# EAGLE design twip-pb2 (EAGLE 9.2.1)
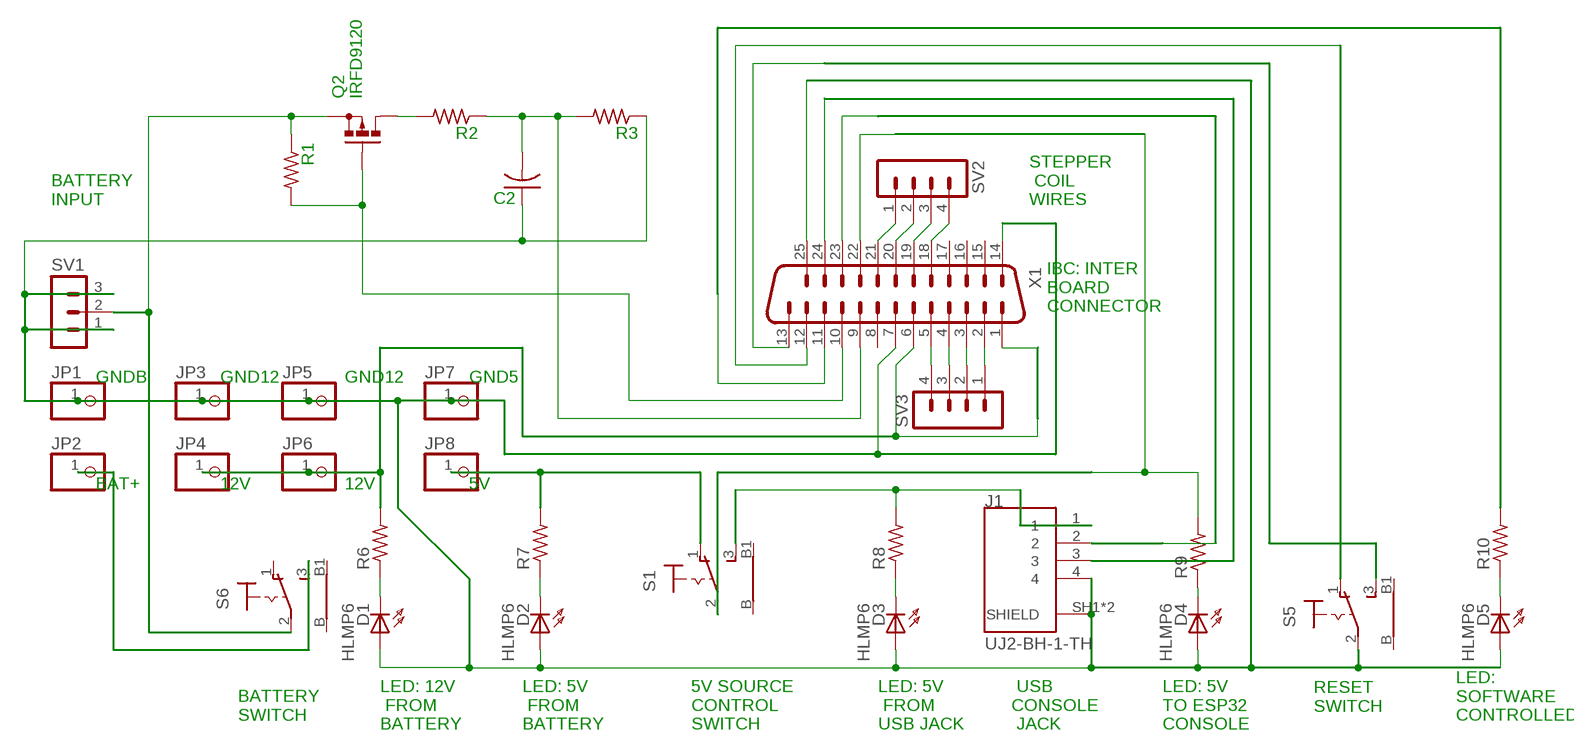
[diagram p0: schematic, sheet 1]

## Parts
C2  C-US050-025X075  [C050-025X075]
D1  HLMP6  [HLMP6]
D2  HLMP6  [HLMP6]
D3  HLMP6  [HLMP6]
D4  HLMP6  [HLMP6]
D5  HLMP6  [HLMP6]
J1  UJ2-BH-1-TH  [CUI_UJ2-BH-1-TH]
JP1  PINHD-1X1  [1X01]
JP2  PINHD-1X1  [1X01]
JP3  PINHD-1X1  [1X01]
JP4  PINHD-1X1  [1X01]
JP5  PINHD-1X1  [1X01]
JP6  PINHD-1X1  [1X01]
JP7  PINHD-1X1  [1X01]
JP8  PINHD-1X1  [1X01]
Q2  IRFD9120  [C370-01]
R1  R-US_0207/10  [0207/10]
R2  R-US_0207/10  [0207/10]
R3  R-US_0207/10  [0207/10]
R6  R-US_0207/10  [0207/10]
R7  R-US_0207/10  [0207/10]
R8  R-US_0207/10  [0207/10]
R9  R-US_0207/10  [0207/10]
R10  R-US_0207/10  [0207/10]
S1  9070-1W  [9070-1W]
S5  9070-1W  [9070-1W]
S6  9070-1W  [9070-1W]
SV1  MA03-1  [MA03-1]
SV2  MA04-1  [MA04-1]
SV3  MA04-1  [MA04-1]
X1  M25VP  [M25VP]

## Nets
N$1: D4.K R9.1
N$2: D1.K R6.1
N$3: D2.K R7.1
N$4: C2.1 D1.A D2.A D3.A D4.A D5.A J1.4 J1.SH1(SHIELD) J1.SH2(SHIELD) JP1.1 JP3.1 JP5.1 JP7.1 R3.1 S5.2(P) SV1.1 SV1.3 X1.7 X1.14 X1.25
N$5: D3.K R8.1
N$6: JP8.1 R7.2 S1.1(O)
N$7: Q2.S R1.1 S6.2(P) SV1.2
N$8: JP4.1 JP6.1 R6.2 X1.1 X1.6
N$9: D5.K R10.1
N$10: JP2.1 S6.3(S)
N$11: SV2.1 X1.21
N$12: S5.1(O) X1.12
N$13: J1.1 R8.2 S1.3(S)
N$14: SV3.1 X1.2
N$15: SV3.2 X1.3
N$16: SV3.3 X1.4
N$17: SV3.4 X1.5
N$18: SV2.2 X1.20
N$19: SV2.3 X1.19
N$20: SV2.4 X1.18
N$21: R10.2 X1.11
N$22: J1.2 X1.23
N$23: J1.3 X1.24
N$24: R9.2 S1.2(P) X1.22
N$25: Q2.D Q2.D1(D) R2.2
N$26: Q2.G R1.2 X1.10
N$28: S5.3(S) X1.13
N$29: C2.2 R2.1 R3.2 X1.9
Unconnected: S1.B S1.B1 S5.B S5.B1 S6.1(O) S6.B S6.B1 X1.8 X1.15 X1.16 X1.17 X1.G1 X1.G2

## Notes on the sheet
- BATTERY
  INPUT
- STEPPER
   COIL
  WIRES
- IBC: INTER 
  BOARD 
  CONNECTOR
- GNDB | GND12 | GND12 | GND5
- BAT+ | 12V | 12V | 5V
- RESET
  SWITCH
- BATTERY 
  SWITCH
- LED: 
  SOFTWARE
  CONTROLLED
- LED: 12V
   FROM
  BATTERY
- LED: 5V
   FROM
  BATTERY
- 5V SOURCE
  CONTROL
  SWITCH
- LED: 5V
   FROM
  USB JACK
- USB
  CONSOLE
   JACK
- LED: 5V
  TO ESP32
  CONSOLE

## Library data of the parts
C2 = rcl:C-US: CAPACITOR, American symbol; SPICEPREFIX: C
D1-D5 = display-hp:HLMP6: LED 2mm horizontal; MF: AGILENT TECHNOLOGIES; MPN: HLMP-6500; OC_FARNELL: 1652490; OC_NEWARK: 40K0088
J1 = UJ2-BH-1-TH:UJ2-BH-1-TH: 3 µin Plating Thickness, Black Insulator, USB Receptacle; MANUFACTURER: CUI INC; PART_REV: 1.0; STANDARD: MANUFACTURER RECOMENDATION
JP1-JP8 = pinhead:PINHD-1X1: PIN HEADER
Q2 = transistor-small-signal:IRFD9120: P-CHANNEL MOS FET
R1-R3 R6-R10 = rcl:R-US_: RESISTOR, American symbol; SPICEPREFIX: R
S1 S5 S6 = switch:9070-1W: TOGGLE SWITCH Marquardt
SV1 = con-lstb:MA03-1: PIN HEADER; OC_FARNELL: unknown; OC_NEWARK: unknown
SV2 SV3 = con-lstb:MA04-1: PIN HEADER; OC_FARNELL: unknown; OC_NEWARK: unknown
X1 = con-subd:M25VP: SUB-D; OC_FARNELL: unknown; OC_NEWARK: unknown

## Board
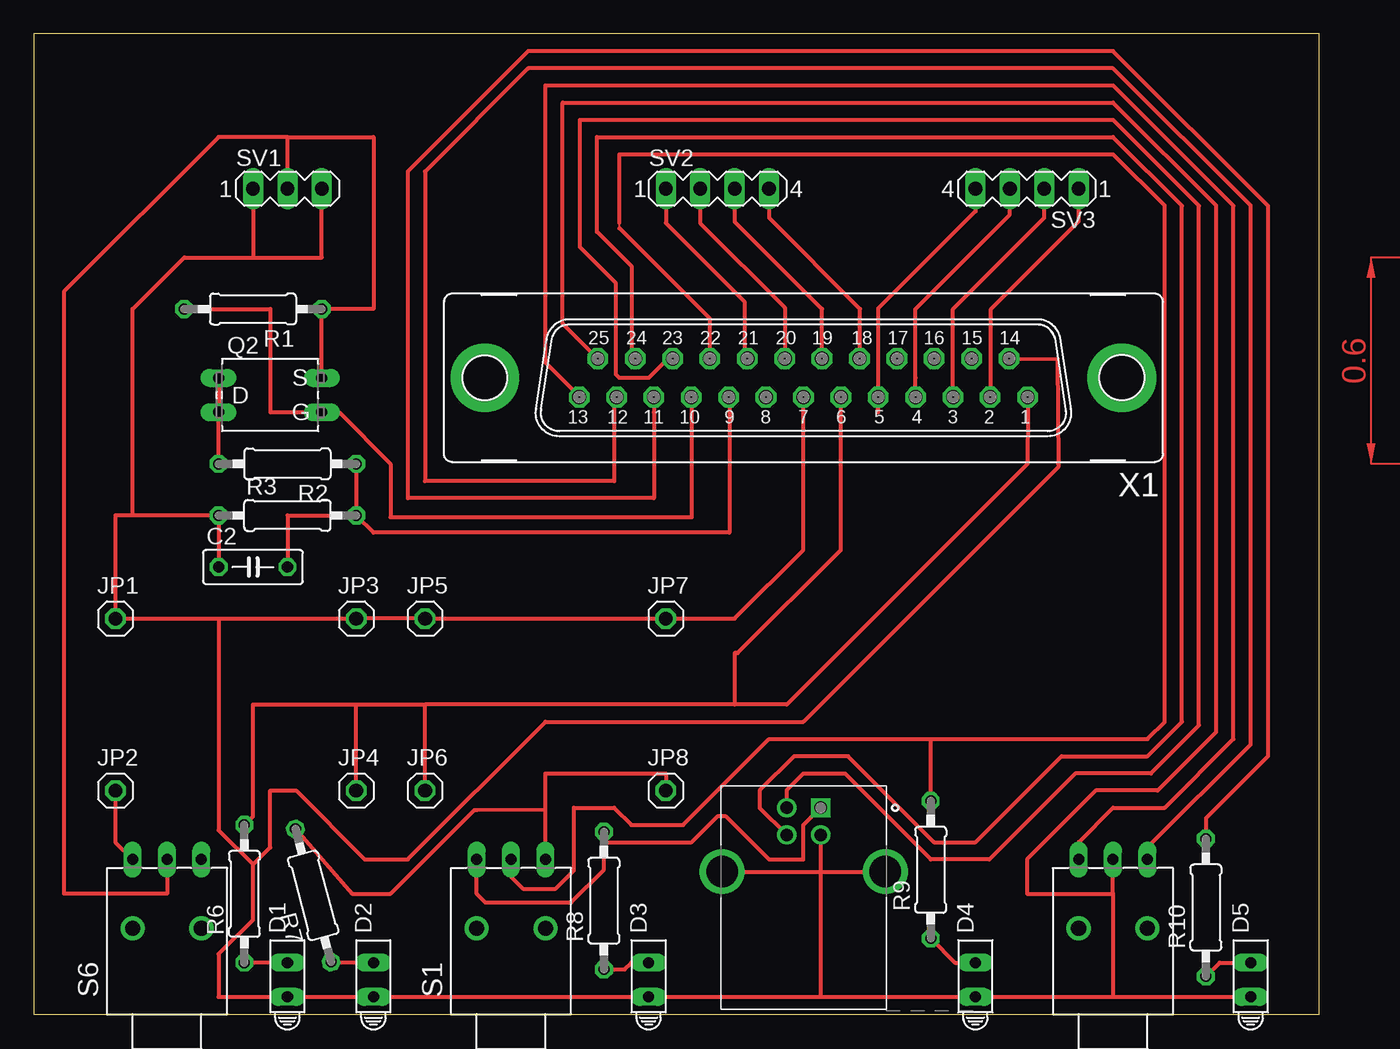
[diagram p1: board, top side]

Size 94.92 x 72.38 mm. Coordinates in mm from the lower left corner, seen from the top.
Outline: 94.92,72.38 0,72.38 0,0 94.92,0 94.92,72.38
Copper layers (1*16): Top 0.035mm / dielectric 1.5mm / Bottom 0.035mm
Design rules "default": minimum track width 6mil, minimum drill 0.35mm, track to track 6mil, track to pad 6mil, pad to pad 6mil, via to via 6mil, smd to smd 6mil, copper to edge 40mil, drill to drill 6mil, minimum pad ring 10mil, minimum via ring 8mil, stop-mask expansion 4mil, vias tented up to drill 0mil, thermal gap 10mil

### Footprints (pad centres in the part's own frame; a part is rotated, then mirrored left to right if it is on the bottom)
C050-025X075 = drill 0.813 octagon: 1 -2.54,0; 2 2.54,0
HLMP6 = drill 0.813 long: A -1.27,0; K 1.27,0
CUI_UJ2-BH-1-TH = drill 0.92 square: 1 0,0 | drill 0.92: 2 -2.5,0; 3 -2.5,-2; 4 0,-2 | drill 2.3: SH1 -7.27,-4.71; SH2 4.77,-4.71
1X01 = drill 1.016 octagon: 1 0,0
C370-01 = drill 0.813 long: D -3.81,1.27; D1 -3.81,-1.27; G 3.81,-1.27; S 3.81,1.27
0207/10 = drill 0.813 octagon: 1 -5.08,0; 2 5.08,0
9070-1W = drill 0.813 long: 1 5.08,-2.54; 2 5.08,0; 3 5.08,2.54 | drill 1.118 pad 1.778: B 0,-2.54; B1 0,2.54
MA03-1 = drill 1.016 long: 1 -2.54,0; 2 0,0; 3 2.54,0
MA04-1 = drill 1.016 long: 1 -3.81,0; 2 -1.27,0; 3 1.27,0; 4 3.81,0
M25VP = drill 1.016 octagon: 1 -16.561,1.422; 2 -13.792,1.422; 3 -11.049,1.422; 4 -8.28,1.422; 5 -5.512,1.422; 6 -2.769,1.422; 7 0,1.422; 8 2.769,1.422; 9 5.512,1.422; 10 8.28,1.422; 11 11.049,1.422; 12 13.792,1.422; 13 16.561,1.422; 14 -15.189,-1.422; 15 -12.421,-1.422; 16 -9.652,-1.422; 17 -6.909,-1.422; 18 -4.14,-1.422; 19 -1.372,-1.422; 20 1.372,-1.422; 21 4.14,-1.422; 22 6.909,-1.422; 23 9.652,-1.422; 24 12.421,-1.422; 25 15.189,-1.422 | drill 3.302 pad 5.08: G1 -23.52,0; G2 23.52,0

### Placement (x,y rotation side)
C2  16.18,33.01 0 top
D1  18.72,2.53 90 top
D2  25.07,2.53 90 top
D3  45.39,2.53 90 top
D4  69.52,2.53 90 top
D5  89.84,2.53 90 top
J1  58.09,15.23 0 top
JP1  6.02,29.2 0 top
JP2  6.02,16.5 0 top
JP3  23.8,29.2 0 top
JP4  23.8,16.5 0 top
JP5  28.88,29.2 0 top
JP6  28.88,16.5 0 top
JP7  46.66,29.2 0 top
JP8  46.66,16.5 0 top
Q2  17.45,45.71 0 top
R1  16.18,52.06 180 top
R2  18.72,40.63 180 top
R3  18.72,36.82 0 top
R6  15.54,8.88 90 top
R7  20.62,8.75 105 top
R8  42.09,8.37 90 top
R9  66.22,10.66 90 top
R10  86.54,7.86 90 top
S1  35.23,6.34 90 top
S5  79.68,6.34 90 top
S6  9.83,6.34 90 top
SV1  18.72,60.95 0 top
SV2  50.47,60.95 0 top
SV3  73.33,60.95 180 top
X1  56.82,46.98 180 top

### Tracks (layer width: path | path; a pad name or v marks a point on that pad's centre or on a via)
N$1
  Top 0.305: R9.1 68,3.8 D4.K
N$2
  Top 0.305: D1.K R6.1
N$3
  Top 0.152: 22.3,3.8 R7.1
  Top 0.305: D2.K 22.3,3.8
N$4
  Top 0.305: 13.64,29.2 JP1.1 6.02,36.82 7.29,36.82 | 13.64,29.2 JP3.1 JP5.1 JP7.1 51.74,29.2 56.82,34.28 X1.7 | 13.64,29.2 13.64,13.58 16.18,11.04 | 58.09,1.26 D3.A D2.A D1.A 13.64,1.26 13.64,4.44 16.18,6.98 16.18,11.04 | 58.09,1.26 D4.A 79.68,1.26 | 58.09,10.52 J1.SH2 | J1.4 58.09,10.52 | 58.09,10.52 58.09,1.26 | 79.68,1.26 D5.A | 79.68,8.88 S5.2 | 79.68,8.88 79.68,1.26 | 16.18,11.04 17.45,12.31 17.45,16.5 19.36,16.5 24.44,11.42 27.61,11.42 37.77,21.58 56.82,21.58 75.63,40.39 75.63,40.63 75.59,48.38 X1.14 | SV1.3 21.26,55.87 16.18,55.87 | 7.29,36.82 7.29,52.06 11.1,55.87 16.18,55.87 | C2.1 R3.1 7.29,36.82 | 79.68,8.88 73.33,8.88 73.33,11.42 78.41,16.5 82.98,16.5 87.3,20.82 87.3,59.68 79.68,67.3 39.04,67.3 39.04,50.99 X1.25 | J1.SH1 58.09,10.52 | SV1.1 16.18,55.87
N$5
  Top 0.305: R8.1 43.61,3.29 44.12,3.8 D3.K
N$6
  Top 0.305: S1.1 37.77,15.12 | 37.77,15.12 37.77,17.77 46.66,17.77 JP8.1 | 37.77,15.12 32.7,15.07 32.53,15.07 26.34,8.88 23.51,8.88 R7.2
N$7
  Top 0.305: S6.2 9.83,8.88 2.21,8.88 2.21,53.33 13.64,64.76 18.72,64.76 | SV1.2 18.72,64.76 | Q2.S R1.1 25.07,52.06 25.07,64.76 18.72,64.76
N$8
  Top 0.152: 73.38,44.44
  Top 0.305: X1.6 59.59,34.28 51.97,26.66 51.74,26.66 51.74,22.85 | JP6.1 28.88,22.85 | 23.8,22.85 28.88,22.85 | JP4.1 23.8,22.85 | R6.2 16.18,14.6 16.18,22.85 23.8,22.85 | 51.74,22.85 28.88,22.85 | 73.38,44.44 73.37,40.63 55.59,22.85 51.74,22.85 | X1.1 73.38,44.44
N$9
  Top 0.305: R10.1 87.55,3.8 D5.K
N$10
  Top 0.305: JP2.1 6.02,12.69 S6.3
N$11
  Top 0.305: SV2.1 46.66,58.41 52.5,52.57 52.5,48.58 X1.21
N$12
  Top 0.305: S5.1 82.22,12.31 89.84,19.93 89.84,59.68 79.68,69.84 36.5,69.84 28.88,62.22 28.88,39.36 42.85,39.36 42.85,45.38 X1.12
N$13
  Top 0.152: 42.09,13.33 R8.2
  Top 0.305: J1.1 56.82,13.96 56.82,11.42 54.28,11.42 51.1,14.6 50.47,14.6 48.56,12.69 42.09,12.69 | S1.3 32.69,8.88 33.32,8.25 39.67,8.25 42.09,10.66 42.09,12.69 | 42.09,12.69 42.09,13.33
N$14
  Top 0.305: X1.2 70.66,45.61 70.66,52.06 77.14,58.54 SV3.1
N$15
  Top 0.305: SV3.2 74.6,58.79 67.87,52.06 X1.3
N$16
  Top 0.305: X1.4 65.1,46.97 65.08,46.98 65.07,52.05 72.06,59.04 SV3.3
N$17
  Top 0.305: X1.5 62.33,44.44 62.32,45.72 62.32,45.87 62.35,45.91 62.35,52.12 69.52,59.28 SV3.4
N$18
  Top 0.305: X1.20 55.45,52.16 49.2,58.41 SV2.2
N$19
  Top 0.305: SV2.3 51.74,58.51 58.19,52.06 X1.19
N$20
  Top 0.305: X1.18 61.01,48.45 61.01,52.06 54.28,58.79 SV2.4
N$21
  Top 0.305: R10.2 86.54,14.47 91.11,19.04 91.11,59.68 79.68,71.11 36.5,71.11 27.61,62.22 27.61,38.09 45.77,38.09 45.77,44.44 X1.11
N$22
  Top 0.305: J1.2 55.59,16.54 56.82,17.77 59.87,17.77 66.22,11.42 70.54,11.42 76.89,17.77 82.47,17.77 86.03,21.33 86.03,59.68 79.68,66.03 40.31,66.03 40.31,56.63 42.98,53.97 42.98,47.23 43.23,46.98 45.39,46.98 46.81,48.4 X1.23
N$23
  Top 0.305: J1.3 53.59,15.23 53.59,16.5 56.13,19.04 60.12,19.04 66.47,12.69 69.52,12.69 75.87,19.04 82.22,19.04 84.76,21.58 84.76,59.68 79.68,64.76 41.58,64.76 41.58,57.77 44.12,55.23 44.12,48.68 X1.24
N$24
  Top 0.152: 43.23,58.03 43.23,58.41
  Top 0.305: S1.2 35.23,10.15 36.12,9.26 38.53,9.26 39.86,10.59 39.86,15.23 42.85,15.23 44.12,13.96 47.93,13.96 54.28,20.31 66.22,20.31 | 66.22,20.31 82.22,20.31 83.49,21.58 83.49,59.68 79.68,63.49 43.23,63.49 43.23,58.41 | R9.2 66.22,20.31 | X1.22 49.91,51.35 43.23,58.03
N$25
  Top 0.305: Q2.D Q2.D1 R2.2
N$26
  Top 0.152: X1.10 48.56,45.53
  Top 0.305: 48.56,45.53 48.56,36.69 26.34,36.69 26.34,40.63 22.53,44.44 Q2.G 17.45,44.44 17.45,52.06 R1.2
N$28
  Top 0.305: S5.3 77.14,12.69 79.68,15.23 83.49,15.23 88.57,20.31 88.57,59.68 79.68,68.57 37.77,68.57 37.77,48.12 40.26,45.63 X1.13
N$29
  Top 0.152: X1.9 51.36,45.51
  Top 0.305: R3.2 18.72,36.82 C2.2 | R2.1 R3.2 | 51.36,45.51 51.36,35.55 25.07,35.55 R3.2
(copper drawn outside any net)
  shapes: Top area x4